# EAGLE schematic filtrosth (EAGLE 7.5.0)
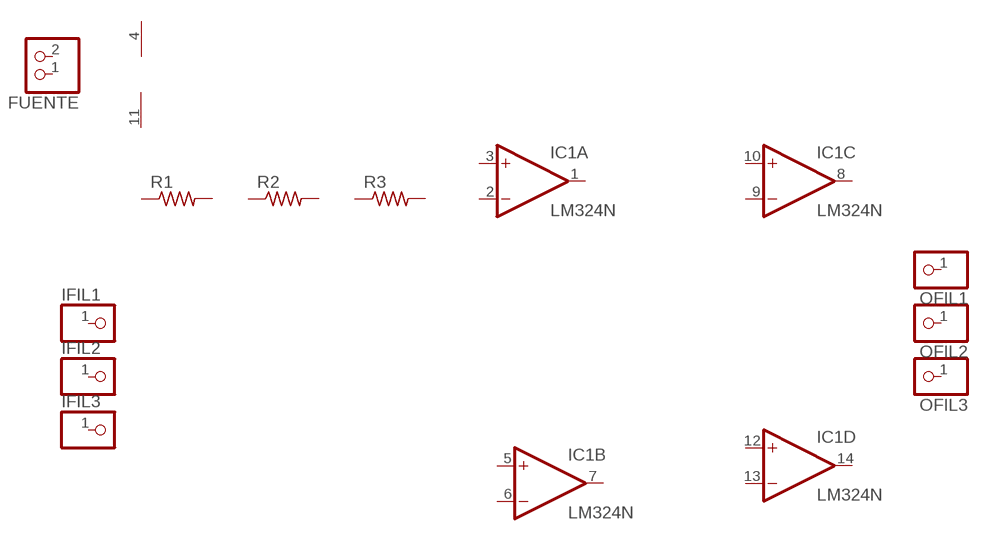
[diagram p0: schematic, sheet 1]

## Parts
FUENTE  PINHD-1X2  [1X02]
IC1  LM324N  [DIL14]
IFIL1  PINHD-1X1  [1X01]
IFIL2  PINHD-1X1  [1X01]
IFIL3  PINHD-1X1  [1X01]
OFIL1  PINHD-1X1  [1X01]
OFIL2  PINHD-1X1  [1X01]
OFIL3  PINHD-1X1  [1X01]
R1  R-US_0207/10  [0207/10]
R2  R-US_0207/10  [0207/10]
R3  R-US_0207/10  [0207/10]
Unconnected: FUENTE.1 FUENTE.2 IC1.1(A:OUT) IC1.2(A:-IN) IC1.3(A:+IN) IC1.5(B:+IN) IC1.6(B:-IN) IC1.7(B:OUT) IC1.8(C:OUT) IC1.9(C:-IN) IC1.10(C:+IN) IC1.12(D:+IN) IC1.13(D:-IN) IC1.14(D:OUT) IFIL1.1 IFIL2.1 IFIL3.1 OFIL1.1 OFIL2.1 OFIL3.1 R1.1 R1.2 R2.1 R2.2 R3.1 R3.2

## Power pins joined to a net without a drawn wire
V+: IC1.4(P:V+)
V-: IC1.11(P:V-)

## Library data of the parts
FUENTE = pinhead:PINHD-1X2: PIN HEADER
IC1 = linear:LM324: OP AMP
IFIL1-IFIL3 OFIL1-OFIL3 = pinhead:PINHD-1X1: PIN HEADER
R1-R3 = rcl:R-US_: RESISTOR, American symbol